# EasyEDA schematic SCH_esp_charge.json
TITLE: esp mini; REV: 1.0; Date: 2022-09-01; Sheet: 1/1; Drawn By: elanworld; Company: cloud box
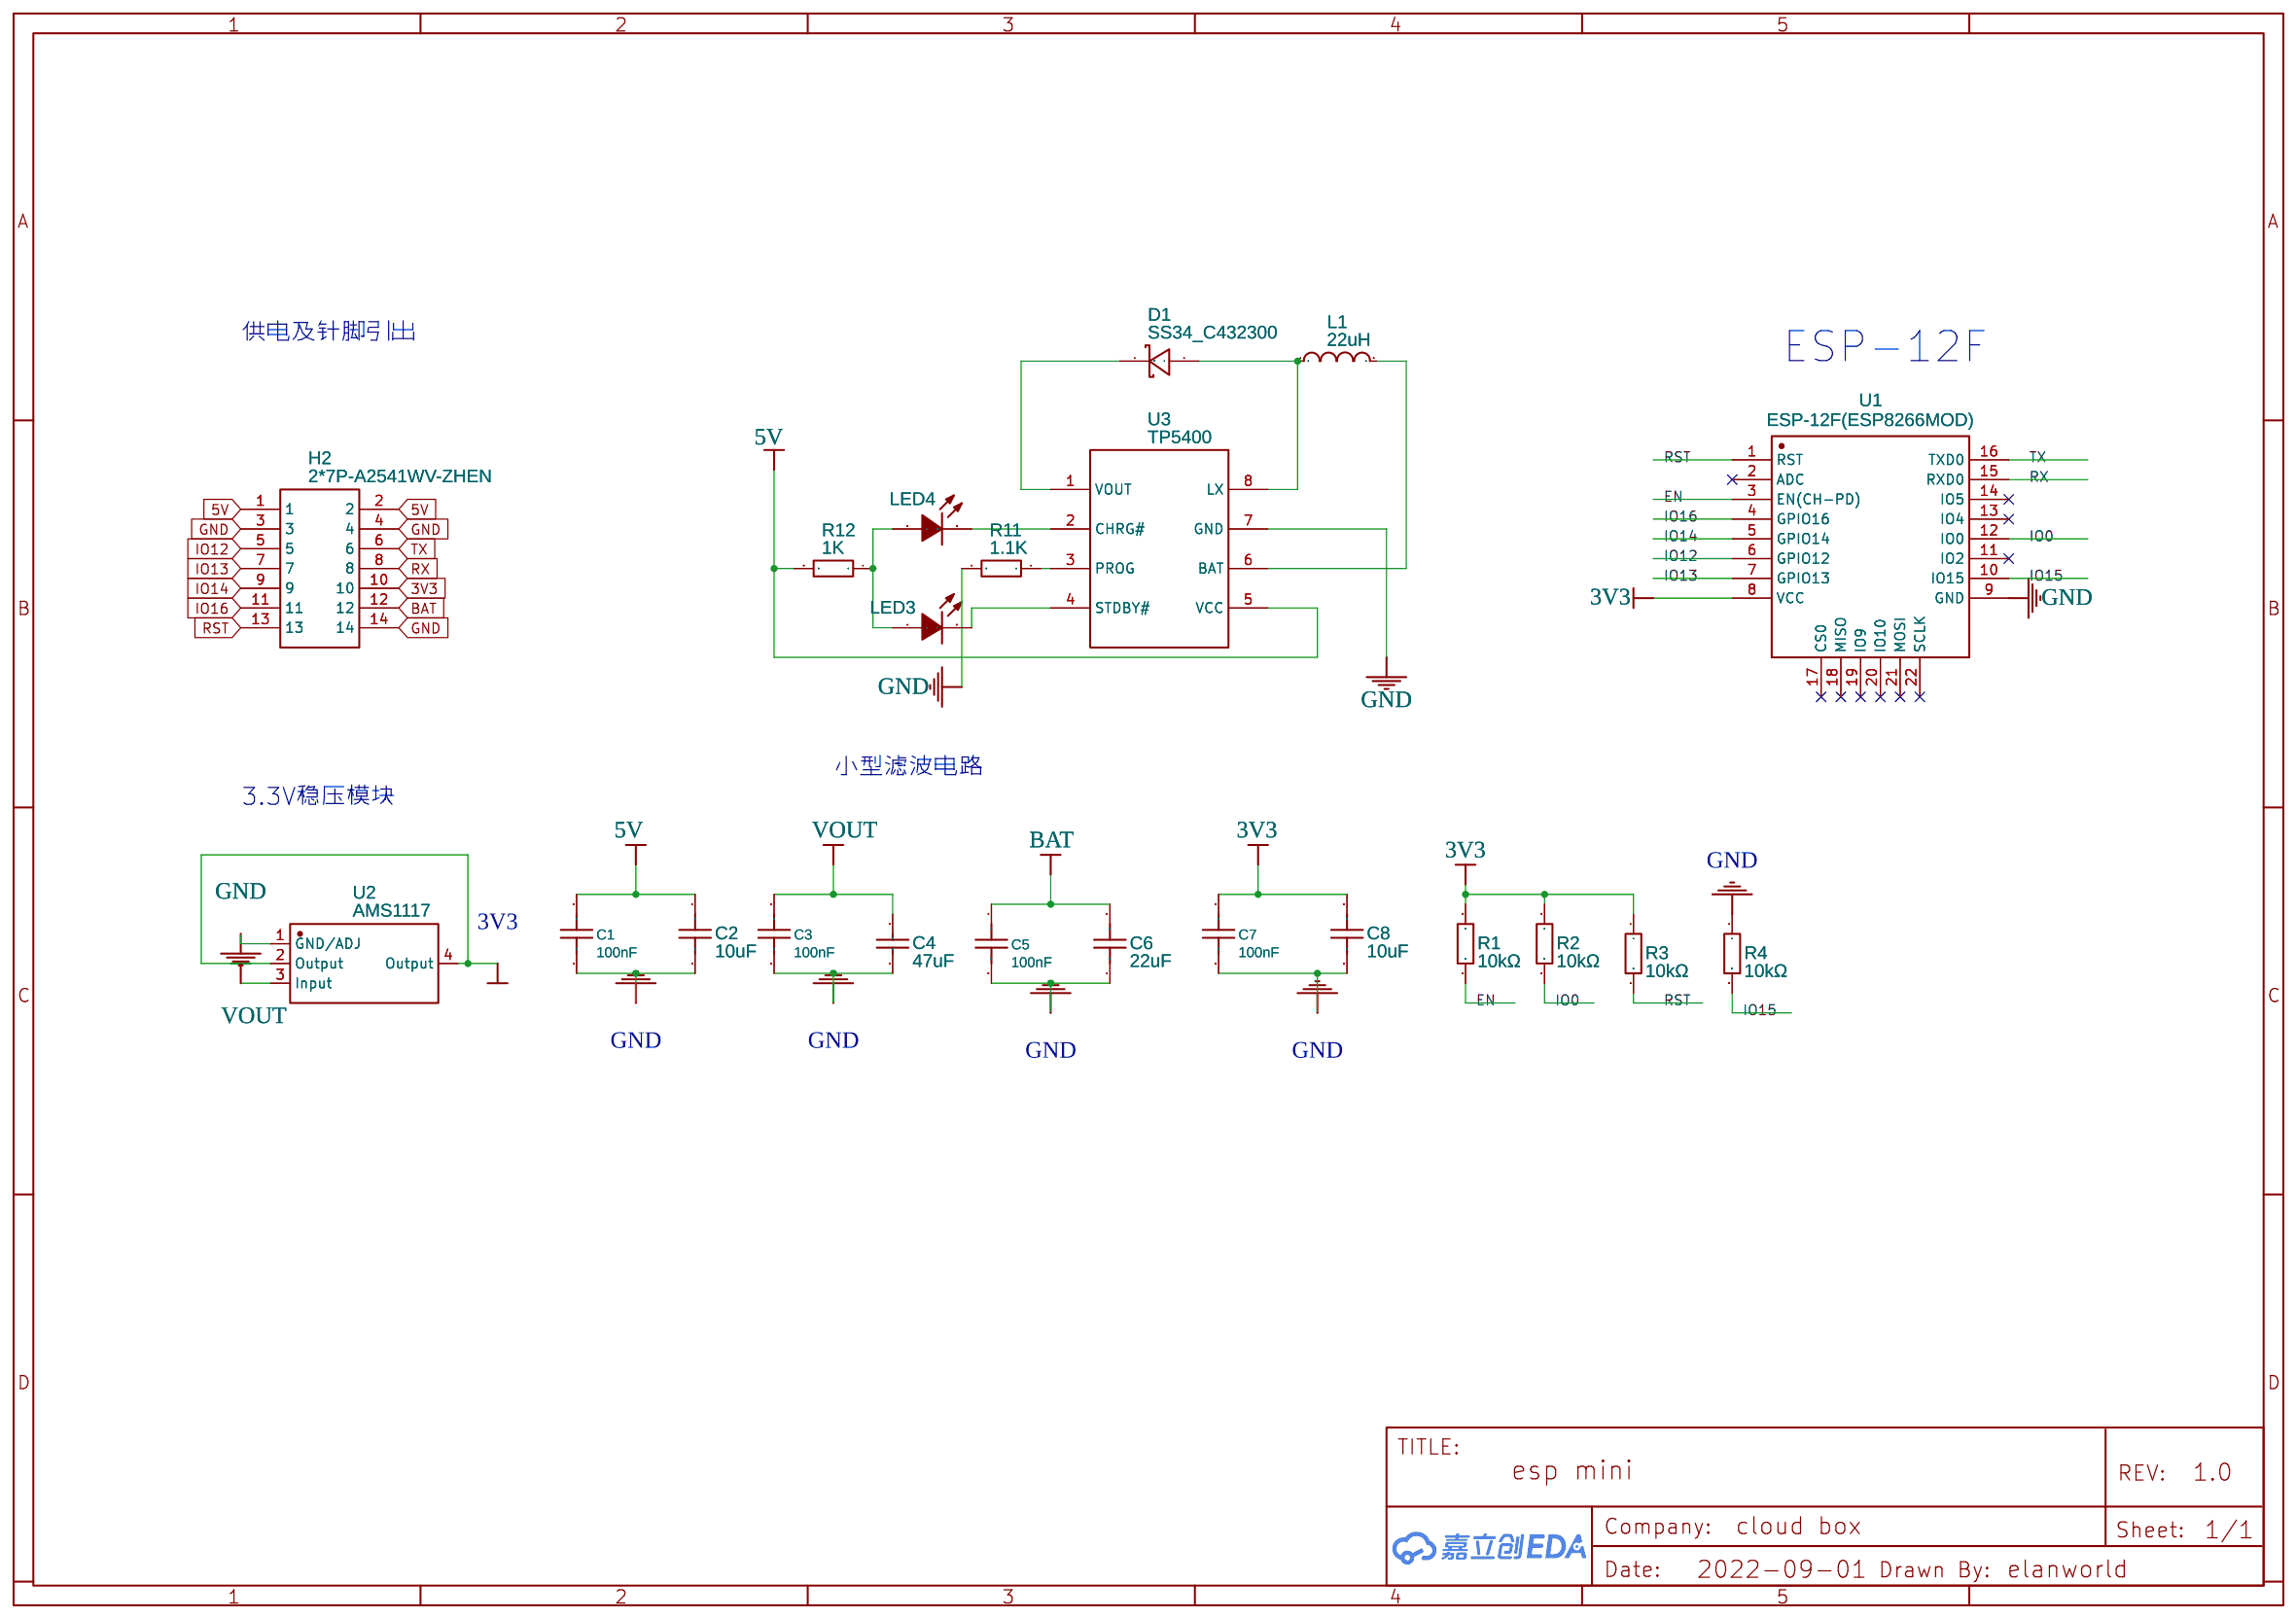
[diagram p0: schematic sheet]

## Parts
C1  100nF  [C0805]
C2  10uF  [C0805]
C3  100nF  [C0805]
C4  47uF  [C0805]
C5  100nF  [C0805]
C6  22uF  [C1206]
C7  100nF  [C0805]
C8  10uF  [C0805]
D1  SS34_C432300  [SMA_L4.4-W2.8-LS5.4-RD]
H2  2*7P-A2541WV-ZHEN  [HDR-TH_14P-P2.54-V-R2-C7-S2.54_A2541WV-2X7P-ZHEN]
L1  22uH  [IND-SMD_L4.5-W4.1_0415CDMCBDS]
LED3  D-W080508W1-KS2  [LED-0805]
LED4  D-W080508W1-KS2  [LED-0805]
R1  10kΩ  [R0805]
R2  10kΩ  [R0805]
R3  10kΩ  [R0805]
R4  10kΩ  [R0805]
R11  1.1K  [R0805]
R12  1K  [R0805]
U1  ESP-12F(ESP8266MOD)  [WIFIM-SMD_ESP-12F-ESP8266MOD]
U2  AMS1117  [SOT-223-4_L6.5-W3.5-P2.30-LS7.0-BR]
U3  TP5400  [SOIC-8_L5.0-W4.0-P1.27-LS6.0-BL-EP]

## Library data of the parts
C1 C3 C5 C7 = 0805B104K101NT: Supplier: LCSC; Manufacturer: FH; Supplier Part: C89258; JLCPCB Part Class: Extended Part
C2 C8 = C0805X6S106K350NT: Supplier: LCSC; Supplier Part: C2844304; Manufacturer: SANYEAR(叁叶源); link: https://atta.szlcsc.com/upload/public/pdf/source/20200102/C475251_1E30ECAC0E8AE7254982658A02A2D78C.pdf; JLCPCB Part Class: Extended Part; Contributor: lcsc
C4 = 0805F476M100NT: Supplier: LCSC; Manufacturer: FH; Supplier Part: C108658; JLCPCB Part Class: Extended Part
C6 = EMK316ABJ226KL-T: Supplier: LCSC; Supplier Part: C319197; Manufacturer: Taiyo Yuden; Contributor: LCSC
D1 = SS34_C432300: Supplier: LCSC; Supplier Part: C432300; Manufacturer: LGE; Manufacturer Part: SS34; Contributor: LCSC; LCSC Assembly: Yes; SMT Type: Extend
H2 = 2*7P-A2541WV-ZHEN: Supplier: LCSC; Supplier Part: C225522; Manufacturer: Changjiang Connectors; Manufacturer Part: A2541WV-2x7P; Contributor: zhangqingtao
L1 = TMPC0402HP-100MG-Z02: Supplier: LCSC; Supplier Part: C305203; Manufacturer: TAITEC; Contributor: LCSC
LED3 LED4 = D-W080508W1-KS2: Supplier: LCSC; Manufacturer: ARKLED; Contributor: LCSC; Supplier Part: C130115
R1-R4 = QR0805F10KP05: Supplier: LCSC; Supplier Part: C176201; Manufacturer: Ever Ohms Tech; Resistance (Ohms): 10K; Contributor: LCSC; JLCPCB Part Class: Extended Part
R11 R12 = 0805W8F1101T5E: Supplier: LCSC; Manufacturer: UniOhm; Supplier Part: C17375; LCSC Assembly: Yes; SMT Type: Extend
U1 = ESP-12F(ESP8266MOD): Supplier: LCSC; Manufacturer: Ai-Thinker; Supplier Part: C82891; JLCPCB Part Class: Extended Part
U2 = AMS1117-3.3_C369933: Supplier: LCSC; Supplier Part: C369933; Manufacturer: KEXIN; Manufacturer Part: AMS1117-3.3; Contributor: LCSC; JLCPCB Part Class: Extended Part
U3 = TP5400: Supplier: LCSC; Manufacturer: TOPPOWER; image: //image.lceda.cn/szlcsc/C24154.jpg; Supplier Part: C24154

## Nets
3V3: C7.1 C8.1 H2.10 R1.1 R2.1 R3.1 U1.8(VCC) U2.2(Output) U2.4(Output)
5V: C1.1 C2.1 H2.1 H2.2 R12.2 U3.5(VCC)
GND: C1.2 C2.2 C3.2 C4.1 C5.2 C6.1 C7.2 C8.2 H2.3 H2.4 H2.14 R4.1 R11.2 U1.9(GND) U2.1(GND/ADJ) U3.7(GND)
BAT: C5.1 C6.2 H2.12
EN: R1.2 U1.3(EN(CH-PD))
IO0: R2.2 U1.12(IO0)
IO12: H2.5 U1.6(GPIO12)
IO13: H2.7 U1.7(GPIO13)
IO14: H2.9 U1.5(GPIO14)
IO15: R4.2 U1.10(IO15)
IO16: H2.11 U1.4(GPIO16)
RST: H2.13 R3.2 U1.1(RST)
RX: H2.8 U1.15(RXD0)
TX: H2.6 U1.16(TXD0)
VOUT: C3.1 C4.2 U2.3(Input)
Net-(D1-1): D1.1(C) U3.1(VOUT)
Net-(D1-2): D1.2(A) L1.1 U3.8(LX)
Net-(L1-2): L1.2 U3.6(BAT)
Net-(LED3-1): LED3.1(A) LED4.1(A) R12.1
Net-(LED3-2): LED3.2(K) U3.4(STDBY#)
Net-(LED4-2): LED4.2(K) U3.2(CHRG#)
Net-(R11-1): R11.1 U3.3(PROG)

Not connected (* = marked no-connect by the designer): U1 2(ADC)* 11(IO2)* 13(IO4)* 14(IO5)* 17(CS0)* 18(MISO)* 19(IO9)* 20(IO10)* 21(MOSI)* 22(SCLK)*

## Notes on the sheet
- 供电及针脚引出
- ESP-12F
- 小型滤波电路
- 3.3V稳压模块
